# Altium schematic sheet GSM Voltage Translator.SchDoc: 3V3 - 1V8 Voltage Level Translator
size 393 x 292 mm; DocumentNumber: 11; SheetNumber: 29; SheetTotal: 40
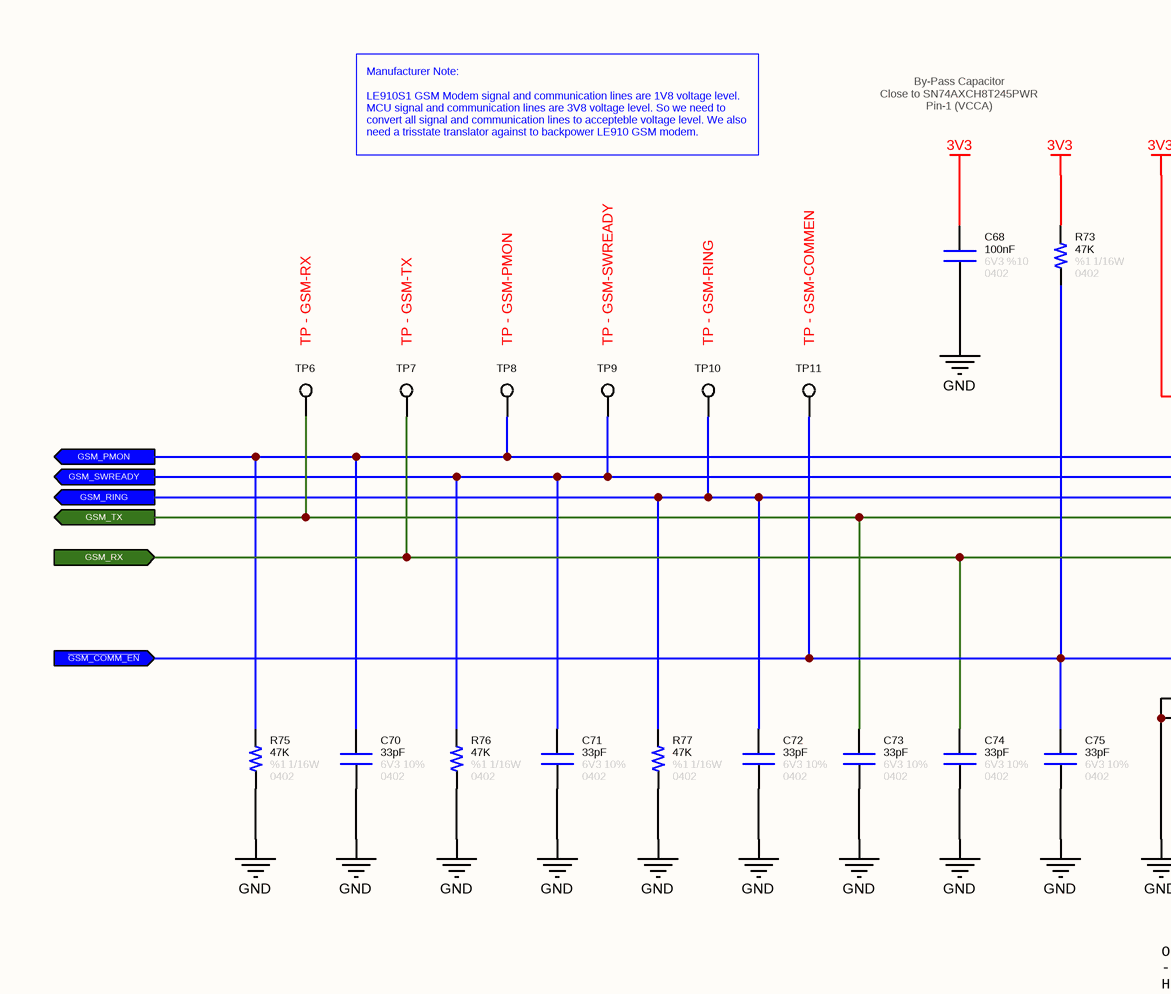
[diagram p0: GSM Voltage Translator.SchDoc, left]
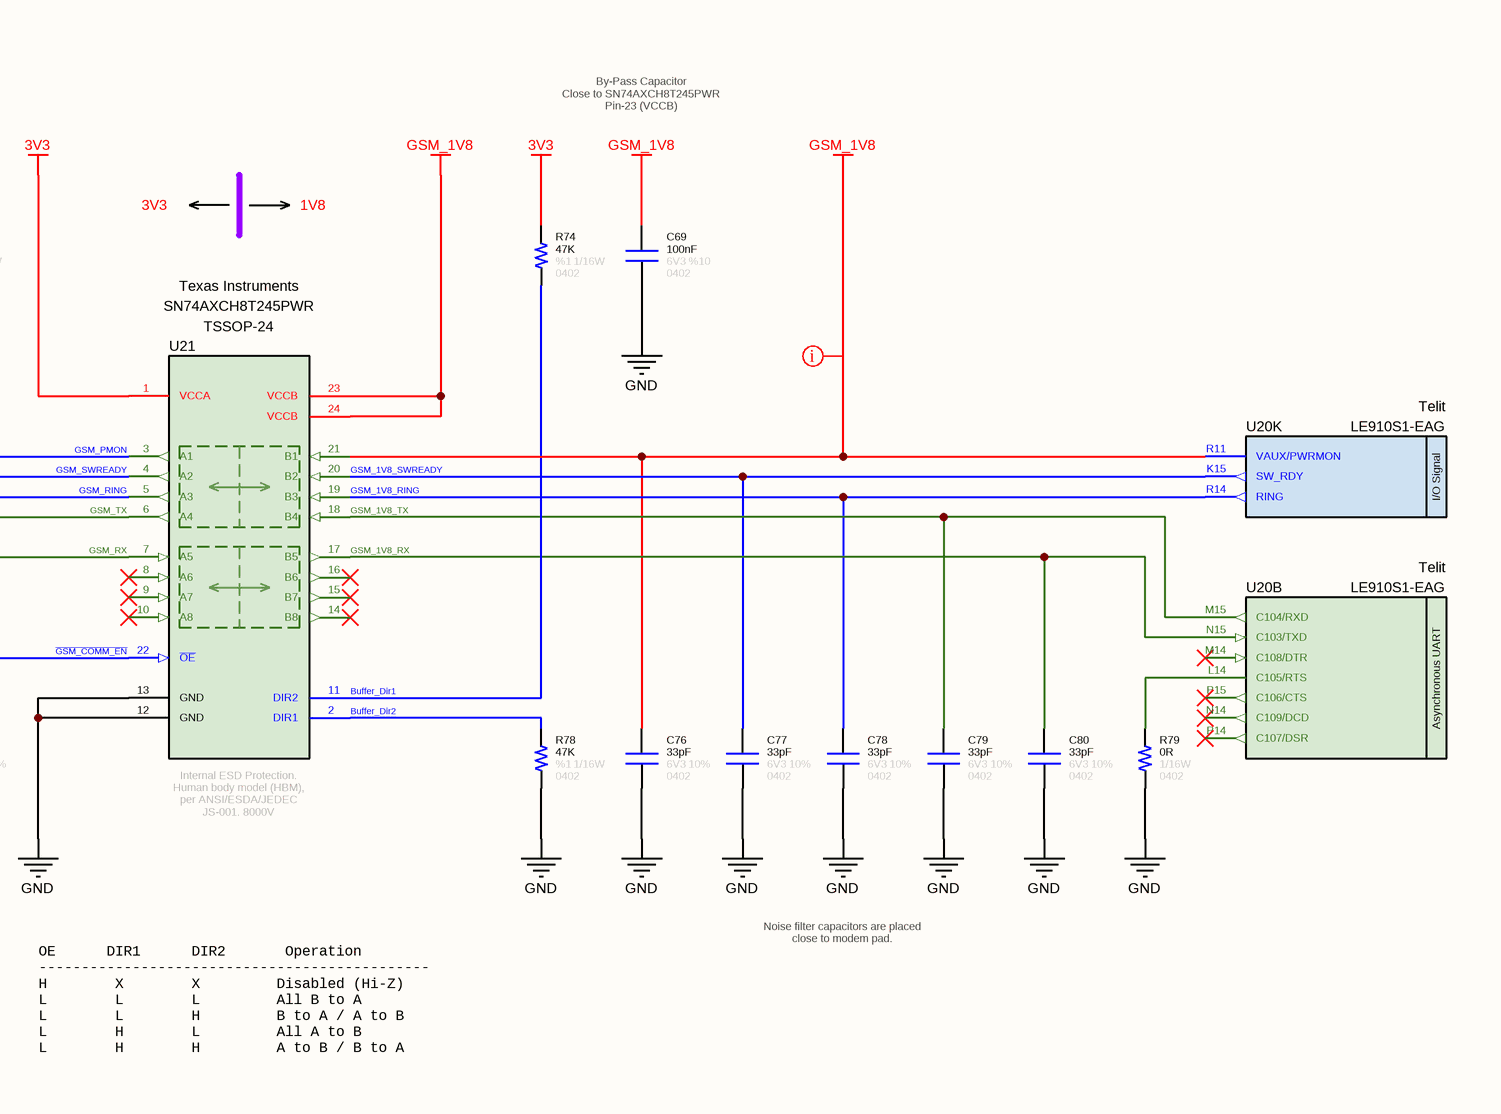
[diagram p1: GSM Voltage Translator.SchDoc, right]

## Parts
C68  value 100nF  Tolerance: %10  Voltage: 6V3  Case: 0402  [CAPACITOR_0402]  (hidden comment: Capacitor - 100nF [0402] (Ceramic))
C69  value 100nF  Tolerance: %10  Voltage: 6V3  Case: 0402  [CAPACITOR_0402]  (hidden comment: Capacitor - 100nF [0402] (Ceramic))
C70  value 33pF  Tolerance: 10%  Case: 0402  Voltage: 6V3  [CAPACITOR_0402]  (hidden comment: Capacitor - 33pF [0402] (Ceramic))
C71  value 33pF  Tolerance: 10%  Case: 0402  Voltage: 6V3  [CAPACITOR_0402]  (hidden comment: Capacitor - 33pF [0402] (Ceramic))
C72  value 33pF  Tolerance: 10%  Case: 0402  Voltage: 6V3  [CAPACITOR_0402]  (hidden comment: Capacitor - 33pF [0402] (Ceramic))
C73  value 33pF  Tolerance: 10%  Case: 0402  Voltage: 6V3  [CAPACITOR_0402]  (hidden comment: Capacitor - 33pF [0402] (Ceramic))
C74  value 33pF  Tolerance: 10%  Case: 0402  Voltage: 6V3  [CAPACITOR_0402]  (hidden comment: Capacitor - 33pF [0402] (Ceramic))
C75  value 33pF  Tolerance: 10%  Case: 0402  Voltage: 6V3  [CAPACITOR_0402]  (hidden comment: Capacitor - 33pF [0402] (Ceramic))
C76  value 33pF  Tolerance: 10%  Case: 0402  Voltage: 6V3  [CAPACITOR_0402]  (hidden comment: Capacitor - 33pF [0402] (Ceramic))
C77  value 33pF  Tolerance: 10%  Case: 0402  Voltage: 6V3  [CAPACITOR_0402]  (hidden comment: Capacitor - 33pF [0402] (Ceramic))
C78  value 33pF  Tolerance: 10%  Case: 0402  Voltage: 6V3  [CAPACITOR_0402]  (hidden comment: Capacitor - 33pF [0402] (Ceramic))
C79  value 33pF  Tolerance: 10%  Case: 0402  Voltage: 6V3  [CAPACITOR_0402]  (hidden comment: Capacitor - 33pF [0402] (Ceramic))
C80  value 33pF  Tolerance: 10%  Case: 0402  Voltage: 6V3  [CAPACITOR_0402]  (hidden comment: Capacitor - 33pF [0402] (Ceramic))
R73  value 47K  Tolerance: %1  Case: 0402  Power: 1/16W  [RESISTOR_0402]  (hidden comment: 47K - 0402 - %1 - 1/16W)
R74  value 47K  Tolerance: %1  Case: 0402  Power: 1/16W  [RESISTOR_0402]  (hidden comment: 47K - 0402 - %1 - 1/16W)
R75  value 47K  Tolerance: %1  Case: 0402  Power: 1/16W  [RESISTOR_0402]  (hidden comment: 47K - 0402 - %1 - 1/16W)
R76  value 47K  Tolerance: %1  Case: 0402  Power: 1/16W  [RESISTOR_0402]  (hidden comment: 47K - 0402 - %1 - 1/16W)
R77  value 47K  Tolerance: %1  Case: 0402  Power: 1/16W  [RESISTOR_0402]  (hidden comment: 47K - 0402 - %1 - 1/16W)
R78  value 47K  Tolerance: %1  Case: 0402  Power: 1/16W  [RESISTOR_0402]  (hidden comment: 47K - 0402 - %1 - 1/16W)
R79  value 0R  Case: 0402  Power: 1/16W  [RESISTOR_0402]  (hidden comment: 0R - 0402 - %1 - 1/16W)
TP6  TP - GSM-RX  [TP]  (no BOM)
TP7  TP - GSM-TX  [TP]  (no BOM)
TP8  TP - GSM-PMON  [TP]  (no BOM)
TP9  TP - GSM-SWREADY  [TP]  (no BOM)
TP10  TP - GSM-RING  [TP]  (no BOM)
TP11  TP - GSM-COMMEN  [TP]  (no BOM)
U20  Manufacturer Part Number: LE910S1-EAG  Manufacturer Name: Telit  [LE910 GSM Modem]  (hidden comment: LE910S1-EAG LTE GSM Module)  (parts B,K of 19)
U21  Manufacturer Name: Texas Instruments  [TSSOP-24]  (hidden comment: SN74AXCH8T245PWR)

## Ports
GSM_PMON (out), GSM_RING (out), GSM_RX (in), GSM_SWREADY (out), GSM_TX (out), ~{GSM_COMM_EN} (in)

## Nets
3V3: C68.2 R73.2 R74.2 U21.1(VCCA)
GND: C68.1 C69.1 C70.1 C71.1 C72.1 C73.1 C74.1 C75.1 C76.1 C77.1 C78.1 C79.1 C80.1 R75.1 R76.1 R77.1 R78.1 R79.1 U21.12(GND) U21.13(GND)
GSM_1V8: C69.2 C76.2 U20.R11(VAUX/PWRMON) U21.21(B1) U21.23(VCCB) U21.24(VCCB)
Buffer_Dir1: R74.1 U21.11(DIR2)
Buffer_Dir2: R78.2 U21.2(DIR1)
~{GSM_COMM_EN}: C75.2 R73.1 TP11.1 U21.22(~{OE}) ; port ~{GSM_COMM_EN}
GSM_1V8_RING: C78.2 U20.R14(RING) U21.19(B3)
GSM_1V8_RX: C80.2 U20.N15(C103/TXD) U21.17(B5)
GSM_1V8_SWREADY: C77.2 U20.K15(SW_RDY) U21.20(B2)
GSM_1V8_TX: C79.2 U20.M15(C104/RXD) U21.18(B4)
GSM_PMON: C70.2 R75.2 TP8.1 U21.3(A1) ; port GSM_PMON
GSM_RING: C72.2 R77.2 TP10.1 U21.5(A3) ; port GSM_RING
GSM_RX: C74.2 TP7.1 U21.7(A5) ; port GSM_RX
GSM_SWREADY: C71.2 R76.2 TP9.1 U21.4(A2) ; port GSM_SWREADY
GSM_TX: C73.2 TP6.1 U21.6(A4) ; port GSM_TX
NetR79_2: R79.2 U20.L14(C105/RTS)

Not connected (* = marked no-connect by the designer): U20 M14(C108/DTR)* N14(C109/DCD)* P14(C107/DSR)* P15(C106/CTS)*; U21 8(A6)* 9(A7)* 10(A8)* 14(B8)* 15(B7)* 16(B6)*

## Layout directives
rule Supply Nets [Voltage = 1.800]: GSM_1V8

## Notes on the sheet
- Manufacturer Note:
  LE910S1 GSM Modem signal and communication lines are 1V8 voltage level.  MCU signal and communication lines are 3V8 voltage level. So we need to convert all signal and communication lines to accepteble voltage level. We also need a trisstate translator against to backpower LE910 GSM modem.
- By-Pass Capacitor
  Close to SN74AXCH8T245PWR
  Pin-1 (VCCA)
- By-Pass Capacitor
  Close to SN74AXCH8T245PWR
  Pin-23 (VCCB)
- 3V3
- 1V8
- Noise filter capacitors are placed close to modem pad.
- OE      DIR1      DIR2       Operation
  ----------------------------------------------
  H        X        X         Disabled (Hi-Z)
  L        L        L         All B to A
  L        L        H         B to A / A to B
  L        H        L         All A to B
  L        H        H         A to B / B to A
- © 2021 All rights reserved.
  This document may not, in whole or in part, be copied, photocopied, reproduced, translated or converted to any electronic or machine readable from without prior written permission of Mehmet Günce Akkoyun.
  Engineer contact : akkoyun@me.com
- Property of
- Engineer :
- Date :
- Size :
- A4
- Time :
- Project :
- Page :
- /
- Customer :
- Product ID :
- Module ID :
- Version :
- File :
- Revision :
- (in symbol IC - LE910S1-EAG, part B) Asynchronous UART
- (in symbol IC - LE910S1-EAG, part K) I/O Signal
- (in symbol IC - SN74AXCH8T245PWR) Internal ESD Protection. / Human body model (HBM), per ANSI/ESDA/JEDEC JS-001. 8000V

## Library data of the parts
C68 C69 = Capacitor - 100nF [0402-6V3]: Capacitor - 100nF [0402-6V3] (Ceramic); Manufacturer Name: AVX; Manufacturer Part Number: 04026D104KAT4A; ComponentLink1Description: Mouser; ComponentLink1URL: https://www.mouser.com.tr/ProductDetail/AVX/04026D104KAT4A?qs=sGAEpiMZZMs0AnBnWHyRQPg4iYkCw7IMED%2F4kpqgf7w%3D; ComponentLink2Description: DataSheet; ComponentLink2URL: https://www.mouser.com.tr/datasheet/2/40/cx5r-776519.pdf
C70-C80 = Capacitor - 33pF [0402-6V3]: Manufacturer Name: Kemet; Manufacturer Part Number: C0402C330J9RACAUTO; ComponentLink1Description: DataSheet; ComponentLink1URL: https://api.kemet.com/component-edge/download/datasheet/C0402C330J9RACAUTO.pdf; ComponentLink2Description: Mouser; ComponentLink2URL: https://www.mouser.com/Search/Refine.aspx?Keyword=80-C0402C330J9RAUTO
R73-R78 = Resistor - 47K [0402]: Thick Film Resistors - SMD 1/16 W 47 KOhm 1%; Manufacturer Name: Vishay; Manufacturer Part Number: CRCW040247K0FKED; ComponentLink1Description: DataSheet; ComponentLink1URL: https://www.mouser.com.tr/datasheet/2/427/dcrcwe3-1762152.pdf; ComponentLink2Description: Mouser; ComponentLink2URL: https://www.mouser.com.tr/ProductDetail/Vishay-Dale/CRCW040247K0FKED?qs=sGAEpiMZZMu61qfTUdNhG2DpbjADlD3GL%252B3h1elTxqU%3D
R79 = Resistor - 0R [0402]: Thick Film Resistors - SMD 1/16 W 0 Ohm; Manufacturer Name: Vishay; Manufacturer Part Number: CRCW04020000Z0ED; ComponentLink1Description: DataSheet; ComponentLink1URL: https://www.mouser.com.tr/datasheet/2/427/dcrcwe3-1762152.pdf; ComponentLink2Description: Mouser; ComponentLink2URL: https://www.mouser.com.tr/ProductDetail/Vishay-Dale/CRCW04020000Z0ED?qs=sGAEpiMZZMu61qfTUdNhG2DpbjADlD3GG34cJb50zyg%3D
TP6-TP11 = PCB - Test Point: Test Point
U20 = IC - LE910S1-EAG: Telit LE910S1-EAG GPRS/GNSS Module; Case: BGA
U21 = IC - SN74AXCH8T245PWR: Translation - Voltage Levels 8-Bit Dual-Supply Bus Transceiver 24-TSSOP -40 to 125; Number of Channels: 8 Channel; Logic Family: AXC; Data Rate: 380Mbps; Channel Type: Bidirectional; Supply Voltage - Min: 0V65; Supply Voltage - Max: 3V6; Output Type: Tri-State, Non-Inverted; Operating Supply Current: 60 uA; Propagation Delay Time: 4 ns; ROHS: Yes; Minimum Operating Temperature: - 40 C; Product Type: Translation - Voltage Levels; Maximum Operating Temperature: + 125 C; Manufacturer Part Number: SN74AXCH8T245PWR; Case: TSSOP-24